# Altium schematic sheet Encoder.SchDoc: Encoders
size Letter; Engineer: Nathan Petersen; DocumentNumber: 21; Revision: v1.2; SheetNumber: 21; SheetTotal: 26
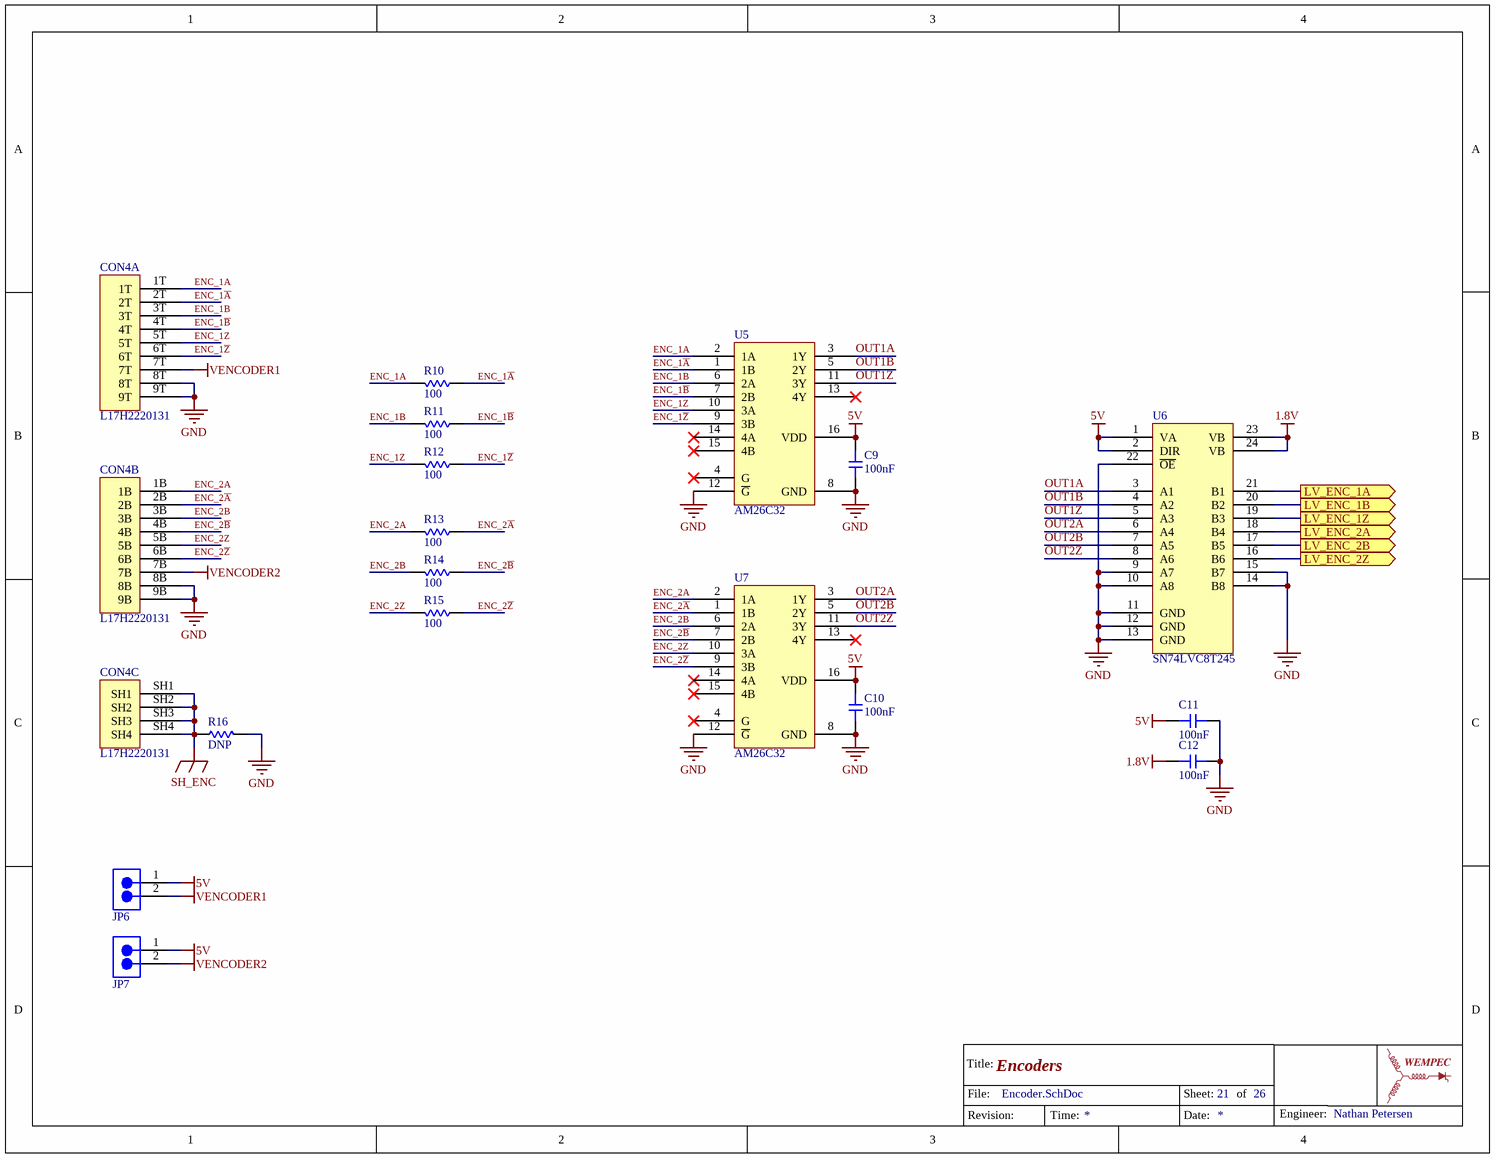
[diagram p0: Encoder.SchDoc]

## Parts
C9  value 100nF  [0603-CAP]  (hidden comment: Capacitor)
C10  value 100nF  [0603-CAP]  (hidden comment: Capacitor)
C11  value 100nF  [0603-CAP]  (hidden comment: Capacitor)
C12  value 100nF  [0603-CAP]  (hidden comment: Capacitor)
CON4  L17H2220131  [L17H2220131]  (parts A,B,C of 3)
JP6  Jumper2  [PIN_HEADER_1x2]  (value not drawn)
JP7  Jumper2  [PIN_HEADER_1x2]  (value not drawn)
R10  value 100  [0603-RES]  (hidden comment: Resistor)
R11  value 100  [0603-RES]  (hidden comment: Resistor)
R12  value 100  [0603-RES]  (hidden comment: Resistor)
R13  value 100  [0603-RES]  (hidden comment: Resistor)
R14  value 100  [0603-RES]  (hidden comment: Resistor)
R15  value 100  [0603-RES]  (hidden comment: Resistor)
R16  value DNP  [0603-RES]  (hidden comment: Resistor)
U5  AM26C32  [TSOP65P640X120-16N]
U6  SN74LVC8T245  [TSOP65P640X120-24N]
U7  AM26C32  [TSOP65P640X120-16N]

## Ports
LV_ENC_1A (out), LV_ENC_1B (out), LV_ENC_1Z (out), LV_ENC_2A (out), LV_ENC_2B (out), LV_ENC_2Z (out)

## Nets
1.8V: C12.1 U6.23(VB) U6.24(VB)
5V: C9.2 C10.2 C11.1 JP6.1 JP7.1 U5.16(VDD) U6.1(VA) U6.2(DIR) U7.16(VDD)
GND: C9.1 C10.1 C11.2 C12.2 CON4.8B CON4.8T CON4.9B CON4.9T R16.2 U5.8(GND) U5.12(~{G}) U6.9(A7) U6.10(A8) U6.11(GND) U6.12(GND) U6.13(GND) U6.14(B8) U6.15(B7) U6.22(~{OE}) U7.8(GND) U7.12(~{G})
SH_ENC: CON4.SH1 CON4.SH2 CON4.SH3 CON4.SH4 R16.1
VENCODER1: CON4.7T JP6.2
VENCODER2: CON4.7B JP7.2
ENC_1A: CON4.1T R10.2 U5.2(1A)
ENC_1~{A}: CON4.2T R10.1 U5.1(1B)
ENC_1B: CON4.3T R11.2 U5.6(2A)
ENC_1~{B}: CON4.4T R11.1 U5.7(2B)
ENC_1Z: CON4.5T R12.2 U5.10(3A)
ENC_1~{Z}: CON4.6T R12.1 U5.9(3B)
ENC_2A: CON4.1B R13.2 U7.2(1A)
ENC_2~{A}: CON4.2B R13.1 U7.1(1B)
ENC_2B: CON4.3B R14.2 U7.6(2A)
ENC_2~{B}: CON4.4B R14.1 U7.7(2B)
ENC_2Z: CON4.5B R15.2 U7.10(3A)
ENC_2~{Z}: CON4.6B R15.1 U7.9(3B)
LV_ENC_1A: U6.21(B1) ; port LV_ENC_1A
LV_ENC_1B: U6.20(B2) ; port LV_ENC_1B
LV_ENC_1Z: U6.19(B3) ; port LV_ENC_1Z
LV_ENC_2A: U6.18(B4) ; port LV_ENC_2A
LV_ENC_2B: U6.17(B5) ; port LV_ENC_2B
LV_ENC_2Z: U6.16(B6) ; port LV_ENC_2Z
OUT1A: U5.3(1Y) U6.3(A1)
OUT1B: U5.5(2Y) U6.4(A2)
OUT1Z: U5.11(3Y) U6.5(A3)
OUT2A: U6.6(A4) U7.3(1Y)
OUT2B: U6.7(A5) U7.5(2Y)
OUT2Z: U6.8(A6) U7.11(3Y)

Not connected (* = marked no-connect by the designer): U5 4(G)* 13(4Y)* 14(4A)* 15(4B)*; U7 4(G)* 13(4Y)* 14(4A)* 15(4B)*

## Notes on the sheet
- Title:
- File:
- Sheet:
- of
- Revision:
- Time:
- Date:
- Engineer:

## Library data of the parts
CON4 = L17H2220131: CONN D-SUB RCPT 9POS R/A SLDR; Supplier 1: Digi-Key; Supplier Part Number 1: L17H2220131-ND
U5 U7 = AM26C32: IC RCVR RS422 QUAD DIFF 16TSSOP; Supplier 1: Digi-Key; Supplier Part Number 1: 296-30088-1-ND
U6 = SN74LVC8T245PWR: IC BUS TRANSCVR 8BIT 24TSSOP; Supplier 1: Digi-Key; Supplier Part Number 1: 296-18593-1-ND
C9-C12 = Capacitor: Supplier 1: Digi-Key; Supplier Part Number 1: 1276-1012-1-ND
JP6 JP7 = Jumper2: Supplier 1: Digi-Key; Supplier Part Number 1: 732-5315-ND
R10-R16 = Resistor: Supplier 1: Digi-Key
  R10-R15: Supplier Part Number 1: YAG3561CT-ND
  R16: Supplier Part Number 1: P0.0GCT-ND